# Altium schematic sheet Altium_TPS63070 DCDC_P1.schdoc
size 309 x 223 mm; Symbol: Sheet-Symbol_A4; Device: Sheet-Symbol_A4; Convert to PCB: yes; Add into BOM: yes; @Project Name: TPS63070 低功耗高效锂电池稳压方案; @Page Count: 1; @Update Date: 2022-08-23; @Create Date: 2022-08-23; @Schematic Name: TPS63070 低功耗高效锂电池稳压方案; @Page No: 1; @Page Name: P1
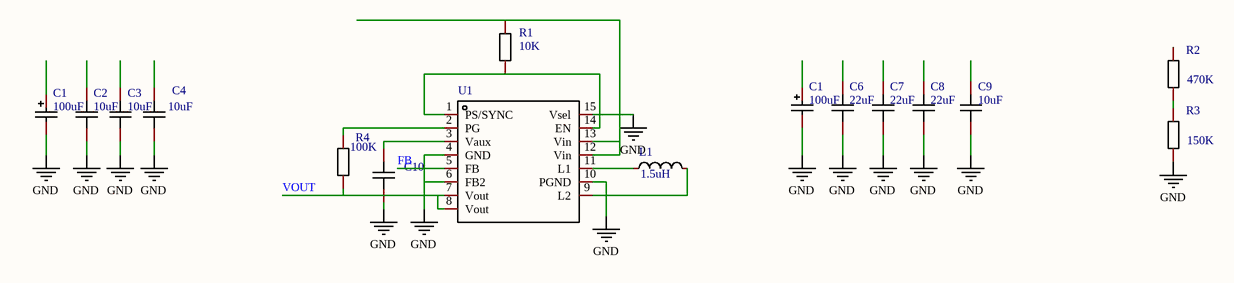
[diagram p0: Altium_TPS63070 DCDC_P1.schdoc]

## Parts
(Parts that share a designator on the sheet are numbered #1, #2 ... from top to bottom, then left to right.)
C1#1  value 100uF  [CAP-SMD_L3.5-W2.8]  (hidden comment: TAJB107K006RNJ)
C1#2  value 100uF  [CAP-SMD_L3.5-W2.8]  (hidden comment: TAJB107K006RNJ)
C2  value 10uF  [C0805]  (hidden comment: CAP_0805)
C3  value 10uF  [C0805]  (hidden comment: CAP_0805)
C4  value 10uF  [C0603]  (hidden comment: CAP_0603)
C6  value 22uF  [C0805]  (hidden comment: CAP_0805)
C7  value 22uF  [C0805]  (hidden comment: CAP_0805)
C8  value 22uF  [C0805]  (hidden comment: CAP_0805)
C9  value 10uF  [C0603]  (hidden comment: CAP_0603)
C10  CAP_0603  [C0603]  (value not drawn)
L1  value 1.5uH  [IND-SMD_L3.0-W3.0]  (hidden comment: SWPA3015S1R5NT)
R1  value 10K  [R0603]  (hidden comment: Res_0603)
R2  value 470K  [R0603]  (hidden comment: Res_0603)
R3  value 150K  [R0603]  (hidden comment: Res_0603)
R4  value 100K  [R0603]  (hidden comment: Res_0603)
U1  TPS63070RNMR  [VQFN-HR-15_L3.0-W2.5-P0.50-BL_TPS63070RNMR]  (value not drawn)

## Nets
GND: C1#1.2 C1#2.2 C2.1 C3.1 C4.1 C6.1 C7.1 C8.1 C9.1 C10.1 R3.2 U1.4(GND) U1.6(FB2) U1.10(PGND) U1.15(Vsel)
FB: U1.5(FB)
VOUT: R4.1 U1.7(Vout) U1.8(Vout)
NetC10_2: C10.2 U1.3(Vaux)
NetL1_1: L1.1 U1.11(L1)
NetL1_2: L1.2 U1.9(L2)
NetR1_1: R1.1 U1.1(PS/SYNC) U1.14(EN)
NetR1_2: R1.2 U1.12(Vin) U1.13(Vin)
NetR2_1: R2.1 R3.1
NetR4_2: R4.2 U1.2(PG)

Not connected (* = marked no-connect by the designer): C1#1 1; C1#2 1; C2 2; C3 2; C4 2; C6 2; C7 2; C8 2; C9 2; R2 2

## Notes on the sheet
- 1
- 2
- 3
- 4
- 5
- 6
- A
- B
- C
- Schematic
- TPS63070 低功耗高效锂电池稳压方案
- Create Date
- Update Date
- 2022-08-23
- Reviewed
- Drawed
- Page
- P1
- Part Number
- D
- VER
- SIZE
- PAGE
- OF

## Library data of the parts
C1#1 C1#2 = TAJB107K006RNJ: 容值:100uF;精度:±10%;额定电压:6.3V;等效串联电阻:1.7Ω@100kHz;工作温度:-55~+125;; Manufacturer: Kyocera AVX; Add into BOM: yes; Tolerance: ±10%; Rated Voltage: 6.3V; Symbol: TAJB107K006RNJ; Device: TAJB107K006RNJ; LCSC Part Name: 100uF ±10% 6.3V; Supplier Part: C16133; Manufacturer Part: TAJB107K006RNJ; Supplier Footprint: CASE-B_3528; JLCPCB Part Class: Basic Part; Datasheet: https://atta.szlcsc.com/upload/public/pdf/source/20160107/1457707750344.pdf; Supplier: LCSC; Convert to PCB: yes; Equivalent Series Resistance(ESR): 1.7Ω@100kHz; Operating Temperature: -55~+125
C2 C3 C6-C8 = CAP_0805: 容值:100nF;精度:±10%;额定电压:50V;温度系数:X7R;; Symbol: C1210X7R475K630NT; Convert to PCB: yes; Device: CAP_0805; Add into BOM: yes; Supplier Footprint: 0805
C4 C9 = CAP_0603: 容值:100nF;精度:±10%;额定电压:50V;温度系数:X7R;; Symbol: C1210X7R475K630NT; Convert to PCB: yes; Device: CAP_0603; Add into BOM: yes; Supplier Footprint: 0603
C10 = CAP_0603: 容值:100nF;精度:±10%;额定电压:50V;温度系数:X7R;; Symbol: C1210X7R475K630NT; Convert to PCB: yes; Value: 100nF; Device: CAP_0603; Add into BOM: yes; Supplier Footprint: 0603
L1 = SWPA3015S1R5NT: 精度:±30%;电感值:1.5uH;直流电阻(DCR):50mΩ;额定电流:1.7A;; Manufacturer: Sunlord(顺络); Add into BOM: yes; Tolerance: ±30%; DC Resistance (DCR): 50mΩ; Rated Current: 1.7A; Symbol: SWPA3015S1R5NT; Device: SWPA3015S1R5NT; LCSC Part Name: 1.5uH ±30%; Supplier Part: C56594; Manufacturer Part: SWPA3015S1R5NT; Supplier Footprint: SMD; JLCPCB Part Class: Extended Part; Datasheet: https://atta.szlcsc.com/upload/public/pdf/source/20181012/C56594_D8F2DEFC9F4E3B67DB1E796B546A8CDD.pdf; Supplier: LCSC; Convert to PCB: yes; Width: 3mm; Height: 1.5mm; Length: 3mm
R1-R4 = Res_0603: Symbol: 电阻; Convert to PCB: yes; Device: Res_0603; Add into BOM: yes; Supplier Footprint: 0603
U1 = TPS63070RNMR: 功能类型:升降压型;同步整流:是;输出通道数:1;拓扑结构:降压-升压式;输入电压:2V~16V;输出电压:2.5V~9V;输出电流(最大值):2A;开关频率:2.4MHz;; Manufacturer: TI(德州仪器); Add into BOM: yes; Function: 升降压型; Synchronous Rectification: 是; Number of Outputs: 1; Topology: 降压-升压式; Input Voltage: 2V~16V; Output Current (Max): 2A; Switching Frequency: 2.4MHz; Symbol: TPS63070RNMR; Device: TPS63070RNMR; LCSC Part Name: 升降压型 2V~16V 2A 2.4MHz; Supplier Part: C109322; Manufacturer Part: TPS63070RNMR; Supplier Footprint: VQFN-HR-15; JLCPCB Part Class: Extended Part; Datasheet: https://atta.szlcsc.com/upload/public/pdf/source/20170810/C109322_1502335154724879675.pdf; Supplier: LCSC; Convert to PCB: yes; Output Voltage: 2.5V~9V